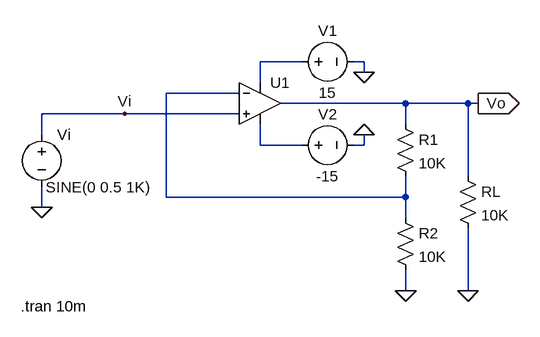
[diagram p0: schematic Run 1_A.asc]
Run 1_A.asc, the LTspice schematic file:
Version 4
SHEET 1 880 680
WIRE 160 -16 96 -16
WIRE 256 -16 240 -16
WIRE 256 0 256 -16
WIRE 96 16 96 -16
WIRE 64 32 -48 32
WIRE 320 48 128 48
WIRE 416 48 320 48
WIRE 432 48 416 48
WIRE -112 64 -240 64
WIRE 64 64 -112 64
WIRE 320 80 320 48
WIRE -240 96 -240 64
WIRE 96 112 96 80
WIRE 160 112 96 112
WIRE 256 112 256 96
WIRE 256 112 240 112
WIRE 416 160 416 48
WIRE -48 192 -48 32
WIRE 320 192 320 160
WIRE 320 192 -48 192
WIRE -240 208 -240 176
WIRE 320 224 320 192
WIRE 320 336 320 304
WIRE 416 336 416 240
FLAG 256 0 0
FLAG 256 96 0
FLAG 320 336 0
FLAG 416 336 0
FLAG 432 48 Vo
IOPIN 432 48 Out
FLAG -240 208 0
FLAG -112 64 Vi
SYMBOL OpAmps\\UniversalOpamp2 96 48 R0
SYMATTR InstName U1
SYMBOL voltage 144 -16 R270
WINDOW 0 32 56 VTop 2
WINDOW 3 -32 56 VBottom 2
WINDOW 123 0 0 Left 0
WINDOW 39 0 0 Left 0
SYMATTR InstName V1
SYMATTR Value 15
SYMBOL voltage 144 112 R270
WINDOW 0 32 56 VTop 2
WINDOW 3 -32 56 VBottom 2
WINDOW 123 0 0 Left 0
WINDOW 39 0 0 Left 0
SYMATTR InstName V2
SYMATTR Value -15
SYMBOL res 304 64 R0
SYMATTR InstName R1
SYMATTR Value 10K
SYMBOL res 304 208 R0
SYMATTR InstName R2
SYMATTR Value 10K
SYMBOL res 400 144 R0
SYMATTR InstName RL
SYMATTR Value 10K
SYMBOL voltage -240 80 R0
WINDOW 3 6 97 Left 2
WINDOW 123 0 0 Left 0
WINDOW 39 0 0 Left 0
SYMATTR Value SINE(0 0.5 1K)
SYMATTR InstName Vi
TEXT -272 360 Left 2 !.tran 10m

The netlist it stands for:
* Run 1_A.asc
XU1 Vi N002 N001 N003 Vo level.2 Avol=1Meg GBW=10Meg Slew=10Meg ilimit=25m rail=0 Vos=0 phimargin=45 en=0 enk=0 in=0 ink=0 Rin=500Meg  ; pins IN+ IN- V+ V- OUT
V1 N001 0 15
V2 N003 0 -15
R1 Vo N002 10K
R2 N002 0 10K
RL Vo 0 10K
Vi Vi 0 SINE(0 0.5 1K)
.tran 10m
.lib UniversalOpamps2.sub
.backanno
.end